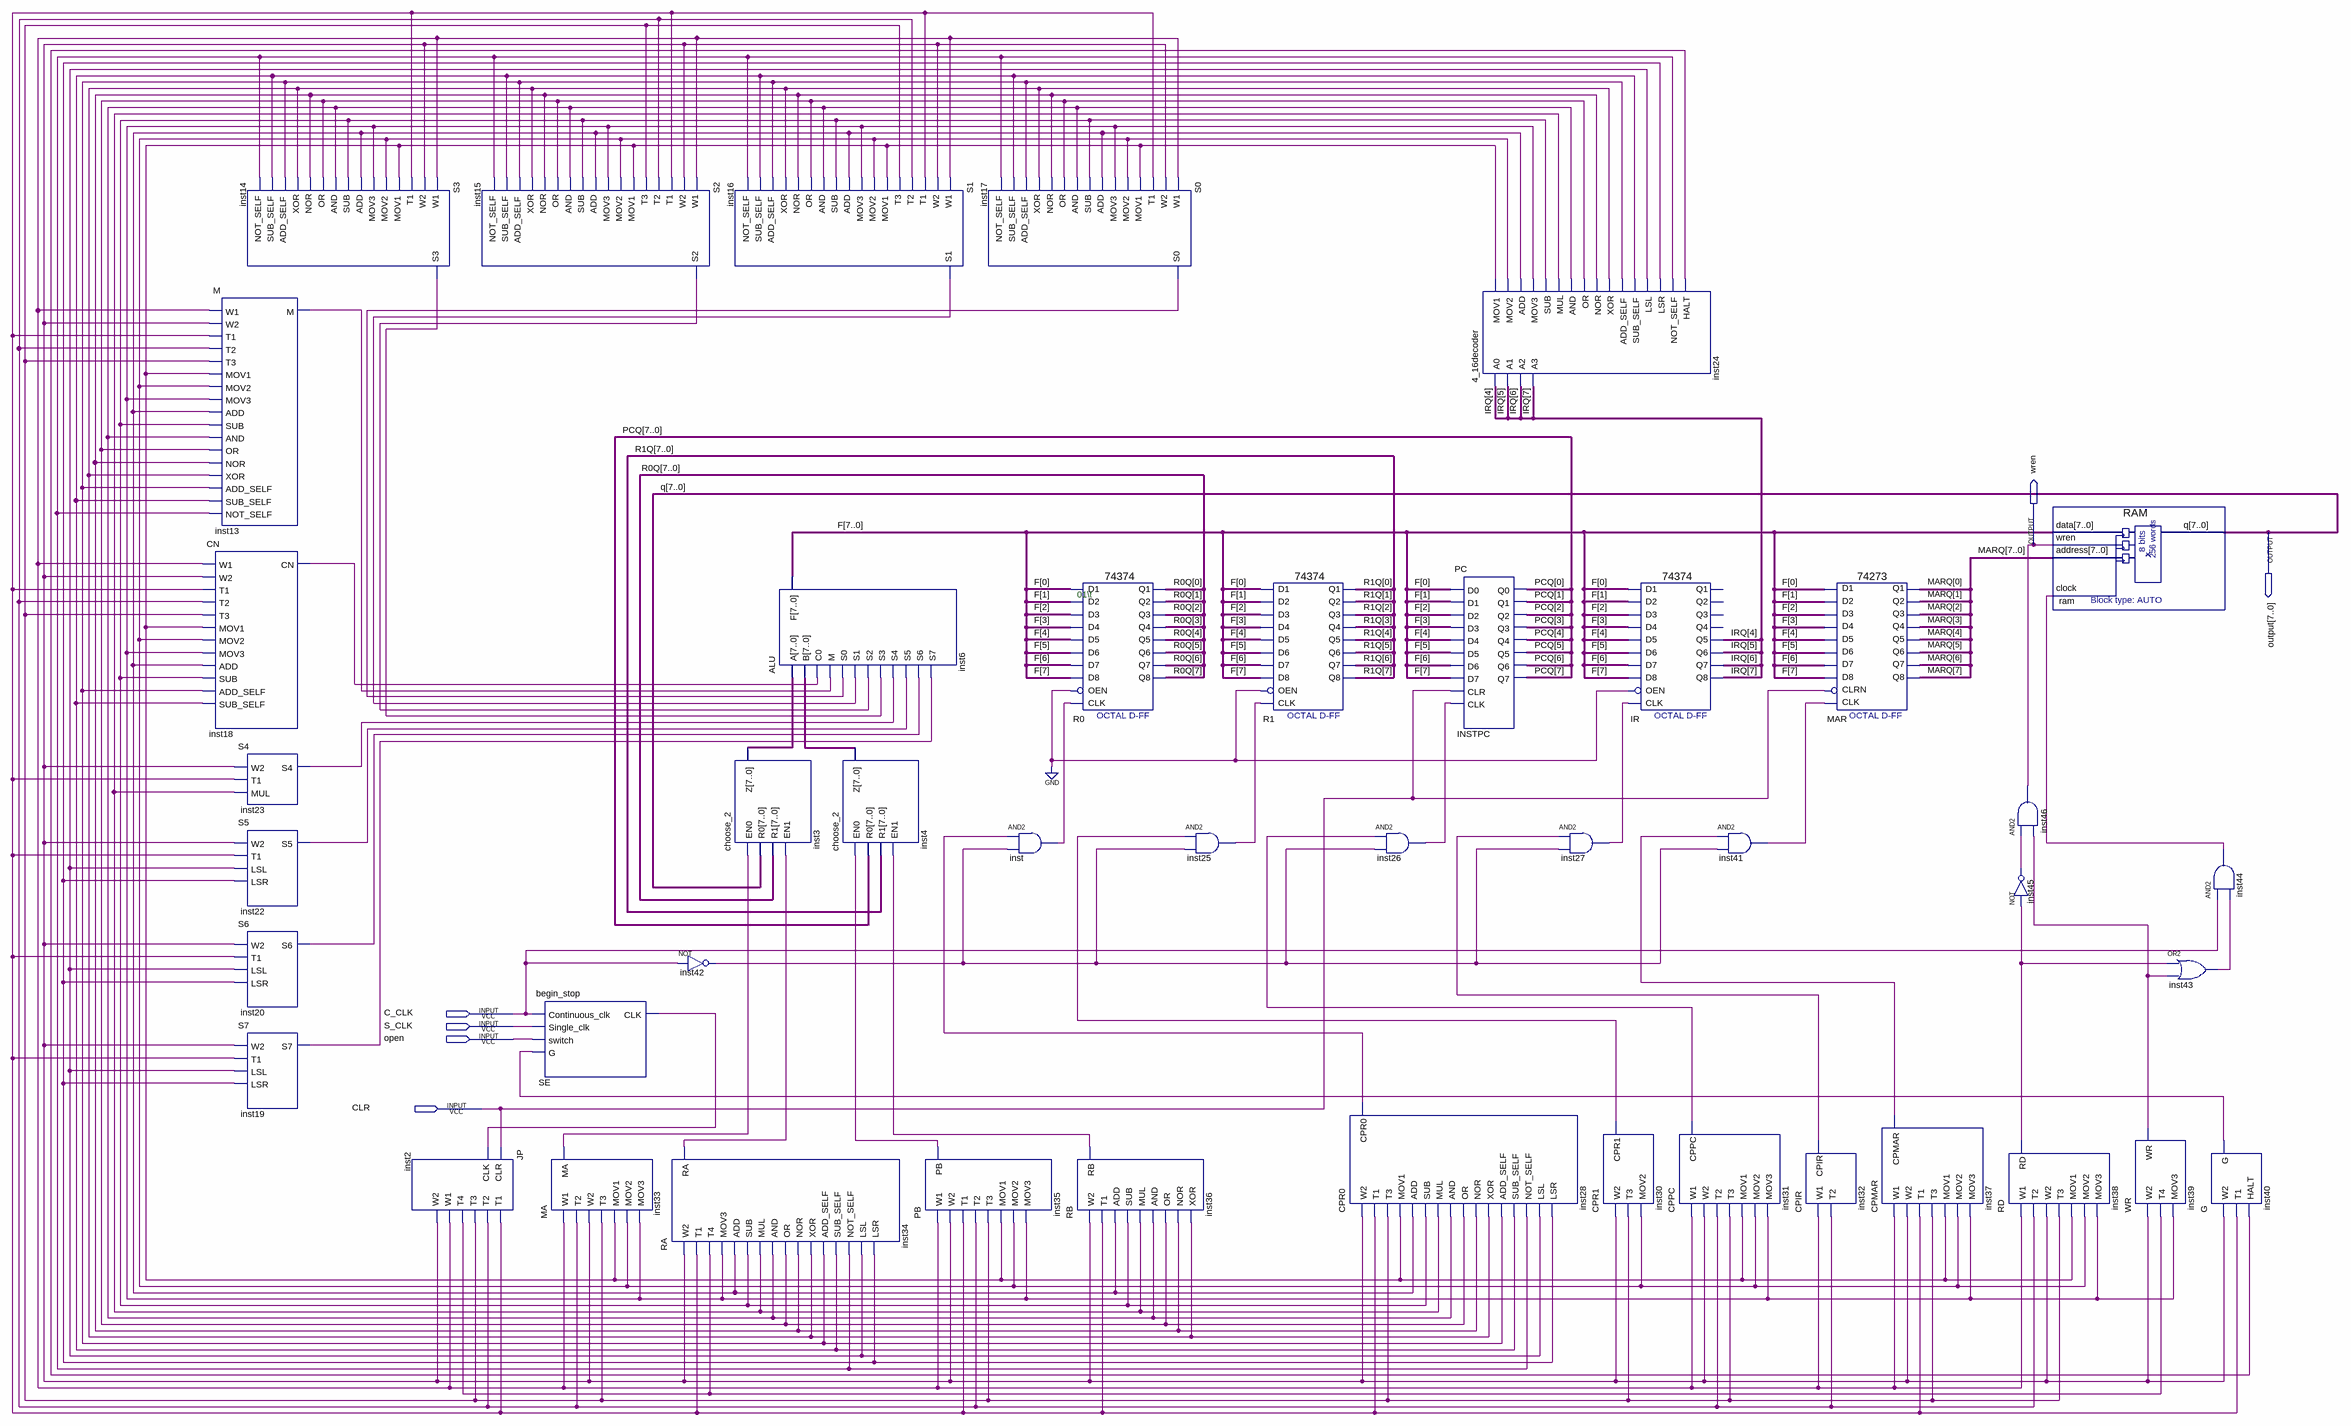
[diagram p0: schematic sheet]
// Quartus schematic ex4.bdf as structural Verilog: 44 symbols, 6 pins
module ex4 (
  input  C_CLK,
  input  S_CLK,
  input  open,
  input  CLR,
  output [7:0] \output ,
  output wren
);

  wire inst2_t1, inst2_t2, inst2_t3, inst2_t4, inst2_w1, inst2_w2, inst13_m, inst14_s3, inst15_s2, inst16_s1,
       inst17_s0, inst18_cn, inst19_s7, inst20_s6, inst22_s5, inst23_s4, inst24_add, inst24_add_self,
       inst24_and, inst24_halt, inst24_lsl, inst24_lsr, inst24_mov1, inst24_mov2, inst24_mov3, inst24_mul,
       inst24_nor, inst24_not_self, inst24_or, inst24_sub, inst24_sub_self, inst24_xor, inst25_out,
       inst26_out, inst27_out, inst28_cpr0, inst30_cpr1, inst31_cppc, inst32_cpir, inst33_ma, inst34_ra,
       inst35_pb, inst36_rb, inst37_cpmar, inst38_rd, inst39_wr, inst40_g, inst41_out, inst42_out,
       inst43_out, inst44_out, inst45_out, inst_out, SE_clk;
  wire [7:0] F, inst3_z, inst4_z, MARQ, PCQ, R0Q, R1Q;
  wire [7:4] IRQ;

  M inst13 (
    .W1(inst2_w1), .W2(inst2_w2), .T1(inst2_t1), .T2(inst2_t2), .T3(inst2_t3), .MOV1(inst24_mov1),
    .MOV2(inst24_mov2), .MOV3(inst24_mov3), .ADD(inst24_add), .SUB(inst24_sub), .AND(inst24_and),
    .OR(inst24_or), .NOR(inst24_nor), .XOR(inst24_xor), .ADD_SELF(inst24_add_self),
    .SUB_SELF(inst24_sub_self), .NOT_SELF(inst24_not_self), .M(inst13_m));
  CN inst18 (
    .W1(inst2_w1), .W2(inst2_w2), .T1(inst2_t1), .T2(inst2_t2), .T3(inst2_t3), .MOV1(inst24_mov1),
    .MOV2(inst24_mov2), .MOV3(inst24_mov3), .ADD(inst24_add), .SUB(inst24_sub), .ADD_SELF(inst24_add_self),
    .SUB_SELF(inst24_sub_self), .CN(inst18_cn));
  S3 inst14 (
    .W1(inst2_w1), .W2(inst2_w2), .T1(inst2_t1), .MOV1(inst24_mov1), .MOV2(inst24_mov2), .MOV3(inst24_mov3),
    .ADD(inst24_add), .SUB(inst24_sub), .AND(inst24_and), .OR(inst24_or), .NOR(inst24_nor), .XOR(inst24_xor),
    .ADD_SELF(inst24_add_self), .SUB_SELF(inst24_sub_self), .NOT_SELF(inst24_not_self), .S3(inst14_s3));
  S4 inst23 (.W2(inst2_w2), .T1(inst2_t1), .MUL(inst24_mul), .S4(inst23_s4));
  S5 inst22 (.W2(inst2_w2), .T1(inst2_t1), .LSL(inst24_lsl), .LSR(inst24_lsr), .S5(inst22_s5));
  S6 inst20 (.W2(inst2_w2), .T1(inst2_t1), .LSL(inst24_lsl), .LSR(inst24_lsr), .S6(inst20_s6));
  S7 inst19 (.W2(inst2_w2), .T1(inst2_t1), .LSL(inst24_lsl), .LSR(inst24_lsr), .S7(inst19_s7));
  JP inst2 (
    .CLR(CLR), .CLK(SE_clk), .T1(inst2_t1), .T2(inst2_t2), .T3(inst2_t3), .T4(inst2_t4), .W1(inst2_w1),
    .W2(inst2_w2));
  S2 inst15 (
    .W1(inst2_w1), .W2(inst2_w2), .T1(inst2_t1), .T2(inst2_t2), .T3(inst2_t3), .MOV1(inst24_mov1),
    .MOV2(inst24_mov2), .MOV3(inst24_mov3), .ADD(inst24_add), .SUB(inst24_sub), .AND(inst24_and),
    .OR(inst24_or), .NOR(inst24_nor), .XOR(inst24_xor), .ADD_SELF(inst24_add_self),
    .SUB_SELF(inst24_sub_self), .NOT_SELF(inst24_not_self), .S2(inst15_s2));
  begin_stop SE (.Continuous_clk(C_CLK), .Single_clk(S_CLK), .switch(open), .G(inst40_g), .CLK(SE_clk));
  MA inst33 (
    .W1(inst2_w1), .T2(inst2_t2), .W2(inst2_w2), .T3(inst2_t3), .MOV1(inst24_mov1), .MOV2(inst24_mov2),
    .MOV3(inst24_mov3), .MA(inst33_ma));
  RA inst34 (
    .W2(inst2_w2), .T1(inst2_t1), .T4(inst2_t4), .MOV3(inst24_mov3), .ADD(inst24_add), .SUB(inst24_sub),
    .MUL(inst24_mul), .AND(inst24_and), .OR(inst24_or), .NOR(inst24_nor), .XOR(inst24_xor),
    .ADD_SELF(inst24_add_self), .SUB_SELF(inst24_sub_self), .NOT_SELF(inst24_not_self), .LSL(inst24_lsl),
    .LSR(inst24_lsr), .RA(inst34_ra));
  S1 inst16 (
    .W1(inst2_w1), .W2(inst2_w2), .T1(inst2_t1), .T2(inst2_t2), .T3(inst2_t3), .MOV1(inst24_mov1),
    .MOV2(inst24_mov2), .MOV3(inst24_mov3), .ADD(inst24_add), .SUB(inst24_sub), .AND(inst24_and),
    .OR(inst24_or), .NOR(inst24_nor), .XOR(inst24_xor), .ADD_SELF(inst24_add_self),
    .SUB_SELF(inst24_sub_self), .NOT_SELF(inst24_not_self), .S1(inst16_s1));
  choose_2 inst3 (.EN0(inst33_ma), .R0(\output ), .R1(R0Q), .EN1(inst34_ra), .Z(inst3_z));
  not inst42 (inst42_out, C_CLK);
  ALU inst6 (
    .A(inst3_z), .B(inst4_z), .C0(inst18_cn), .M(inst13_m), .S0(inst17_s0), .S1(inst16_s1), .S2(inst15_s2),
    .S3(inst14_s3), .S4(inst23_s4), .S5(inst22_s5), .S6(inst20_s6), .S7(inst19_s7), .F(F));
  choose_2 inst4 (.EN0(inst35_pb), .R0(PCQ), .R1(R1Q), .EN1(inst36_rb), .Z(inst4_z));
  PB inst35 (
    .W1(inst2_w1), .W2(inst2_w2), .T1(inst2_t1), .T2(inst2_t2), .T3(inst2_t3), .MOV1(inst24_mov1),
    .MOV2(inst24_mov2), .MOV3(inst24_mov3), .PB(inst35_pb));
  S0 inst17 (
    .W1(inst2_w1), .W2(inst2_w2), .T1(inst2_t1), .MOV1(inst24_mov1), .MOV2(inst24_mov2), .MOV3(inst24_mov3),
    .ADD(inst24_add), .SUB(inst24_sub), .AND(inst24_and), .OR(inst24_or), .NOR(inst24_nor), .XOR(inst24_xor),
    .ADD_SELF(inst24_add_self), .SUB_SELF(inst24_sub_self), .NOT_SELF(inst24_not_self), .S0(inst17_s0));
  and inst (inst_out, inst28_cpr0, inst42_out);
  \74374  R0 (
    .D1(F[0]), .D2(F[1]), .D3(F[2]), .D4(F[3]), .D6(F[5]), .D5(F[4]), .OEN(1'b0), .D8(F[7]), .D7(F[6]),
    .CLK(inst_out), .Q2(R0Q[1]), .Q3(R0Q[2]), .Q5(R0Q[4]), .Q4(R0Q[3]), .Q6(R0Q[5]), .Q7(R0Q[6]),
    .Q8(R0Q[7]), .Q1(R0Q[0]));
  RB inst36 (
    .W2(inst2_w2), .T1(inst2_t1), .ADD(inst24_add), .SUB(inst24_sub), .MUL(inst24_mul), .AND(inst24_and),
    .OR(inst24_or), .NOR(inst24_nor), .XOR(inst24_xor), .RB(inst36_rb));
  and inst25 (inst25_out, inst30_cpr1, inst42_out);
  \74374  R1 (
    .D1(F[0]), .D2(F[1]), .D3(F[2]), .D4(F[3]), .D6(F[5]), .D5(F[4]), .OEN(1'b0), .D8(F[7]), .D7(F[6]),
    .CLK(inst25_out), .Q2(R1Q[1]), .Q3(R1Q[2]), .Q5(R1Q[4]), .Q4(R1Q[3]), .Q6(R1Q[5]), .Q7(R1Q[6]),
    .Q8(R1Q[7]), .Q1(R1Q[0]));
  and inst26 (inst26_out, inst31_cppc, inst42_out);
  CPR0 inst28 (
    .W2(inst2_w2), .T1(inst2_t1), .T3(inst2_t3), .MOV1(inst24_mov1), .ADD(inst24_add), .SUB(inst24_sub),
    .MUL(inst24_mul), .AND(inst24_and), .OR(inst24_or), .NOR(inst24_nor), .XOR(inst24_xor),
    .ADD_SELF(inst24_add_self), .SUB_SELF(inst24_sub_self), .NOT_SELF(inst24_not_self), .LSL(inst24_lsl),
    .LSR(inst24_lsr), .CPR0(inst28_cpr0));
  \4_16decoder  inst24 (
    .A0(IRQ[4]), .A1(IRQ[5]), .A2(IRQ[6]), .A3(IRQ[7]), .MOV1(inst24_mov1), .MOV2(inst24_mov2),
    .ADD(inst24_add), .MOV3(inst24_mov3), .SUB(inst24_sub), .MUL(inst24_mul), .AND(inst24_and),
    .OR(inst24_or), .NOR(inst24_nor), .XOR(inst24_xor), .ADD_SELF(inst24_add_self),
    .SUB_SELF(inst24_sub_self), .LSL(inst24_lsl), .LSR(inst24_lsr), .NOT_SELF(inst24_not_self),
    .HALT(inst24_halt));
  PC INSTPC (
    .D0(F[0]), .D1(F[1]), .D2(F[2]), .D3(F[3]), .D4(F[4]), .D5(F[5]), .D6(F[6]), .D7(F[7]), .CLR(CLR),
    .CLK(inst26_out), .Q0(PCQ[0]), .Q1(PCQ[1]), .Q2(PCQ[2]), .Q3(PCQ[3]), .Q4(PCQ[4]), .Q5(PCQ[5]),
    .Q6(PCQ[6]), .Q7(PCQ[7]));
  and inst27 (inst27_out, inst32_cpir, inst42_out);
  \74374  IR (
    .D1(F[0]), .D2(F[1]), .D3(F[2]), .D4(F[3]), .D6(F[5]), .D5(F[4]), .OEN(1'b0), .D8(F[7]), .D7(F[6]),
    .CLK(inst27_out), .Q5(IRQ[4]), .Q6(IRQ[5]), .Q7(IRQ[6]), .Q8(IRQ[7]));  // open: Q2, Q3, Q4, Q1
  CPR1 inst30 (.W2(inst2_w2), .T3(inst2_t3), .MOV2(inst24_mov2), .CPR1(inst30_cpr1));
  CPPC inst31 (
    .W1(inst2_w1), .W2(inst2_w2), .T2(inst2_t2), .T3(inst2_t3), .MOV1(inst24_mov1), .MOV2(inst24_mov2),
    .MOV3(inst24_mov3), .CPPC(inst31_cppc));
  and inst41 (inst41_out, inst37_cpmar, inst42_out);
  \74273  MAR (
    .D2(F[1]), .D3(F[2]), .D1(F[0]), .D4(F[3]), .D7(F[6]), .D6(F[5]), .D5(F[4]), .D8(F[7]), .CLK(inst41_out),
    .CLRN(CLR), .Q4(MARQ[3]), .Q1(MARQ[0]), .Q2(MARQ[1]), .Q3(MARQ[2]), .Q6(MARQ[5]), .Q5(MARQ[4]),
    .Q7(MARQ[6]), .Q8(MARQ[7]));
  CPIR inst32 (.W1(inst2_w1), .T2(inst2_t2), .CPIR(inst32_cpir));
  CPMAR inst37 (
    .W1(inst2_w1), .W2(inst2_w2), .T1(inst2_t1), .T3(inst2_t3), .MOV1(inst24_mov1), .MOV2(inst24_mov2),
    .MOV3(inst24_mov3), .CPMAR(inst37_cpmar));
  and inst46 (wren, inst45_out, inst39_wr);
  not inst45 (inst45_out, inst38_rd);
  RD inst38 (
    .W1(inst2_w1), .T2(inst2_t2), .W2(inst2_w2), .T3(inst2_t3), .MOV1(inst24_mov1), .MOV2(inst24_mov2),
    .MOV3(inst24_mov3), .RD(inst38_rd));
  RAM ram (.data(F), .wren(wren), .address(MARQ), .clock(inst44_out), .q(\output ));
  WR inst39 (.W2(inst2_w2), .T4(inst2_t4), .MOV3(inst24_mov3), .WR(inst39_wr));
  or inst43 (inst43_out, inst38_rd, inst39_wr);
  and inst44 (inst44_out, C_CLK, inst43_out);
  G inst40 (.W2(inst2_w2), .T1(inst2_t1), .HALT(inst24_halt), .G(inst40_g));

  // Other names for the same wires on the sheet: q[7:0] = \output 

  // Notes on the sheet:
  //   01\t
endmodule
